# Altium schematic sheet CHIBI CODEC DSP_20181126.SchDoc: Title
size A2; PageSetup: Record=PageOptions|CenterHorizontal=True|CenterVertical=True|PrintScale=0.49|XCorrection=1.00|YCorrection=1.00|PrintKind=0|BorderSize=5000000|LeftOffset=0|BottomOffset=0|Orientation=2|PaperLength=1000|PaperWidth=1000|Scale=100|PaperSource=7|PrintQuality=-4|MediaType=1|DitherType=10|PaperKind=Letter|PrintScaleMode=1; ApprovedBy: Enter Name; CheckedBy: Enter Name; DrawnBy: Enter Name; Organization: Tymphany; Address1: 2/F, BBK Building; Address2: No. 89 Ande Street, Shang Meilin; Address3: Futian District, Shenzhen; Address4: GuangDong, P.R.C. 518049, China; DocumentNumber: 4; Revision: 0.0.0; SheetNumber: 4; SheetTotal: 6; ProductName: Product Name; PartNumber: Part Number; ModifiedBy: Enter Name; LeadEngineer: Enter Name; Stage: Concept; ProjectName: Project Name
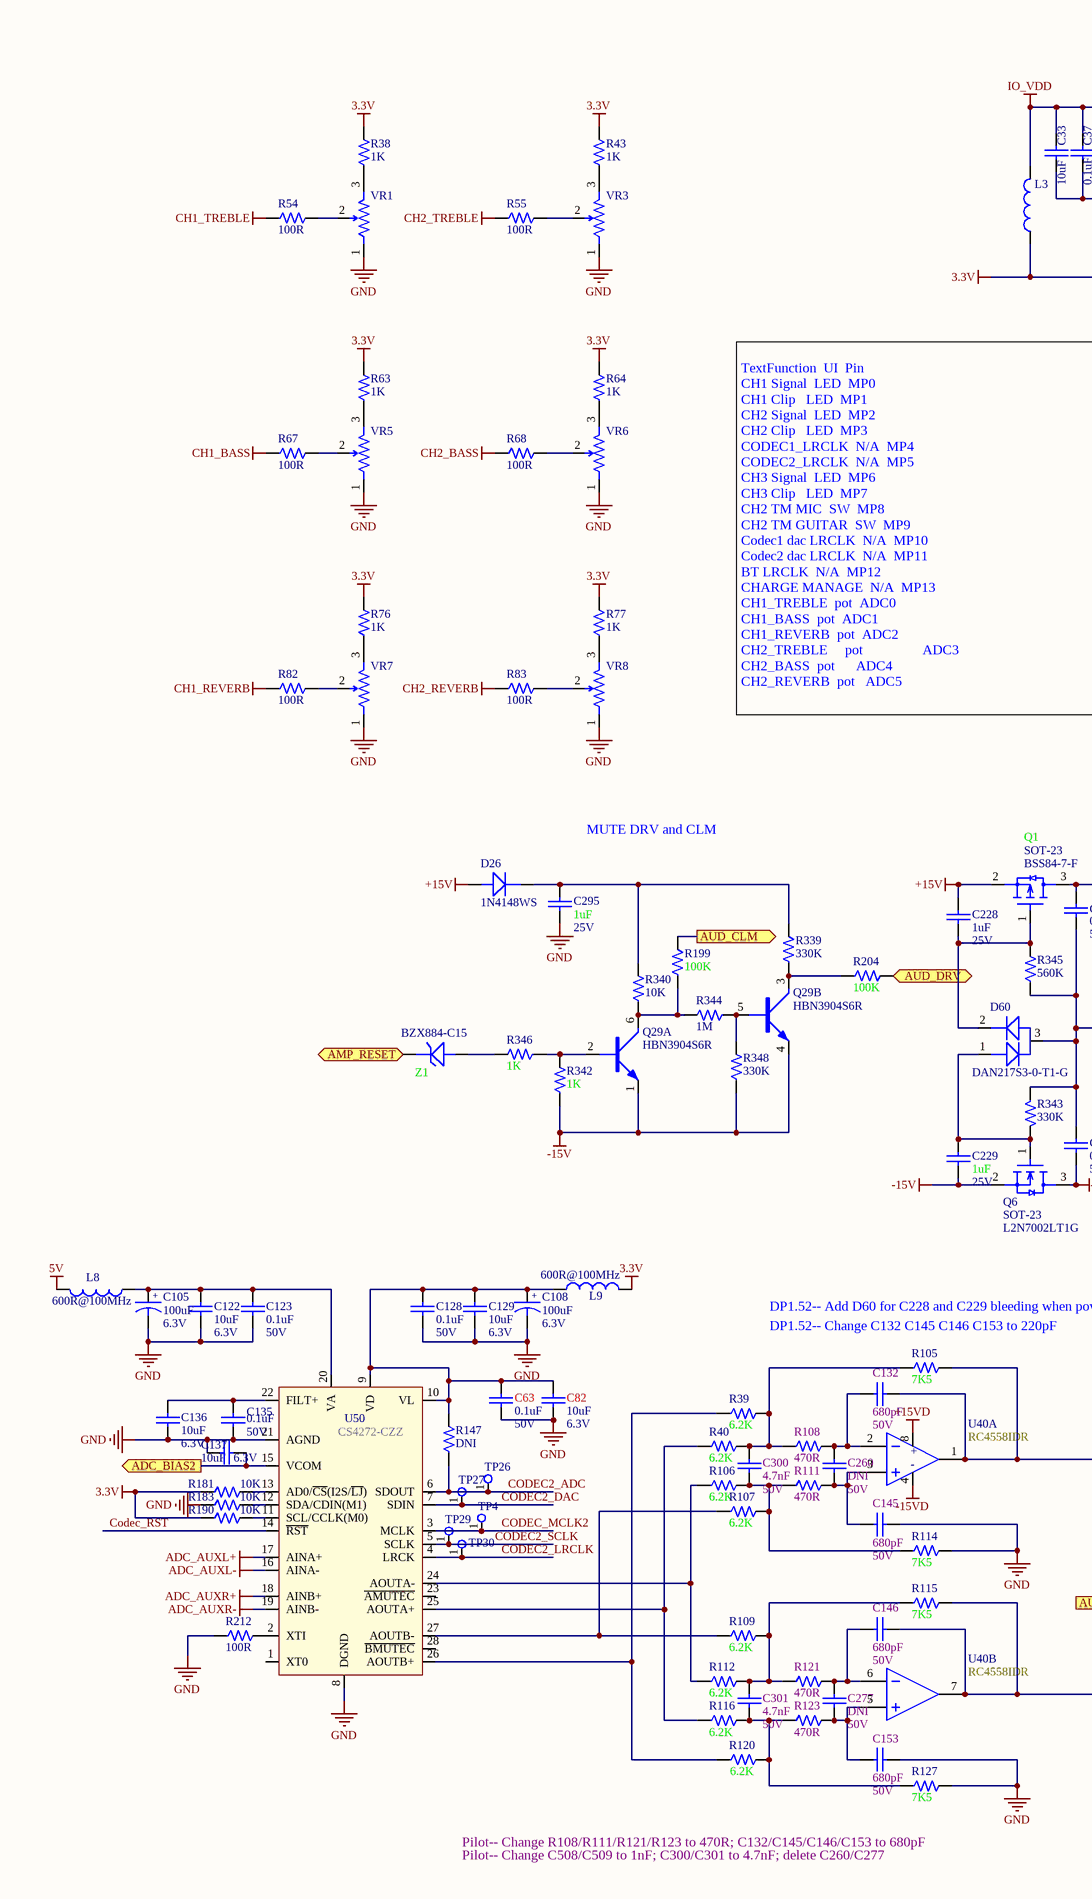
[diagram p0: CHIBI CODEC DSP_20181126.SchDoc, left]
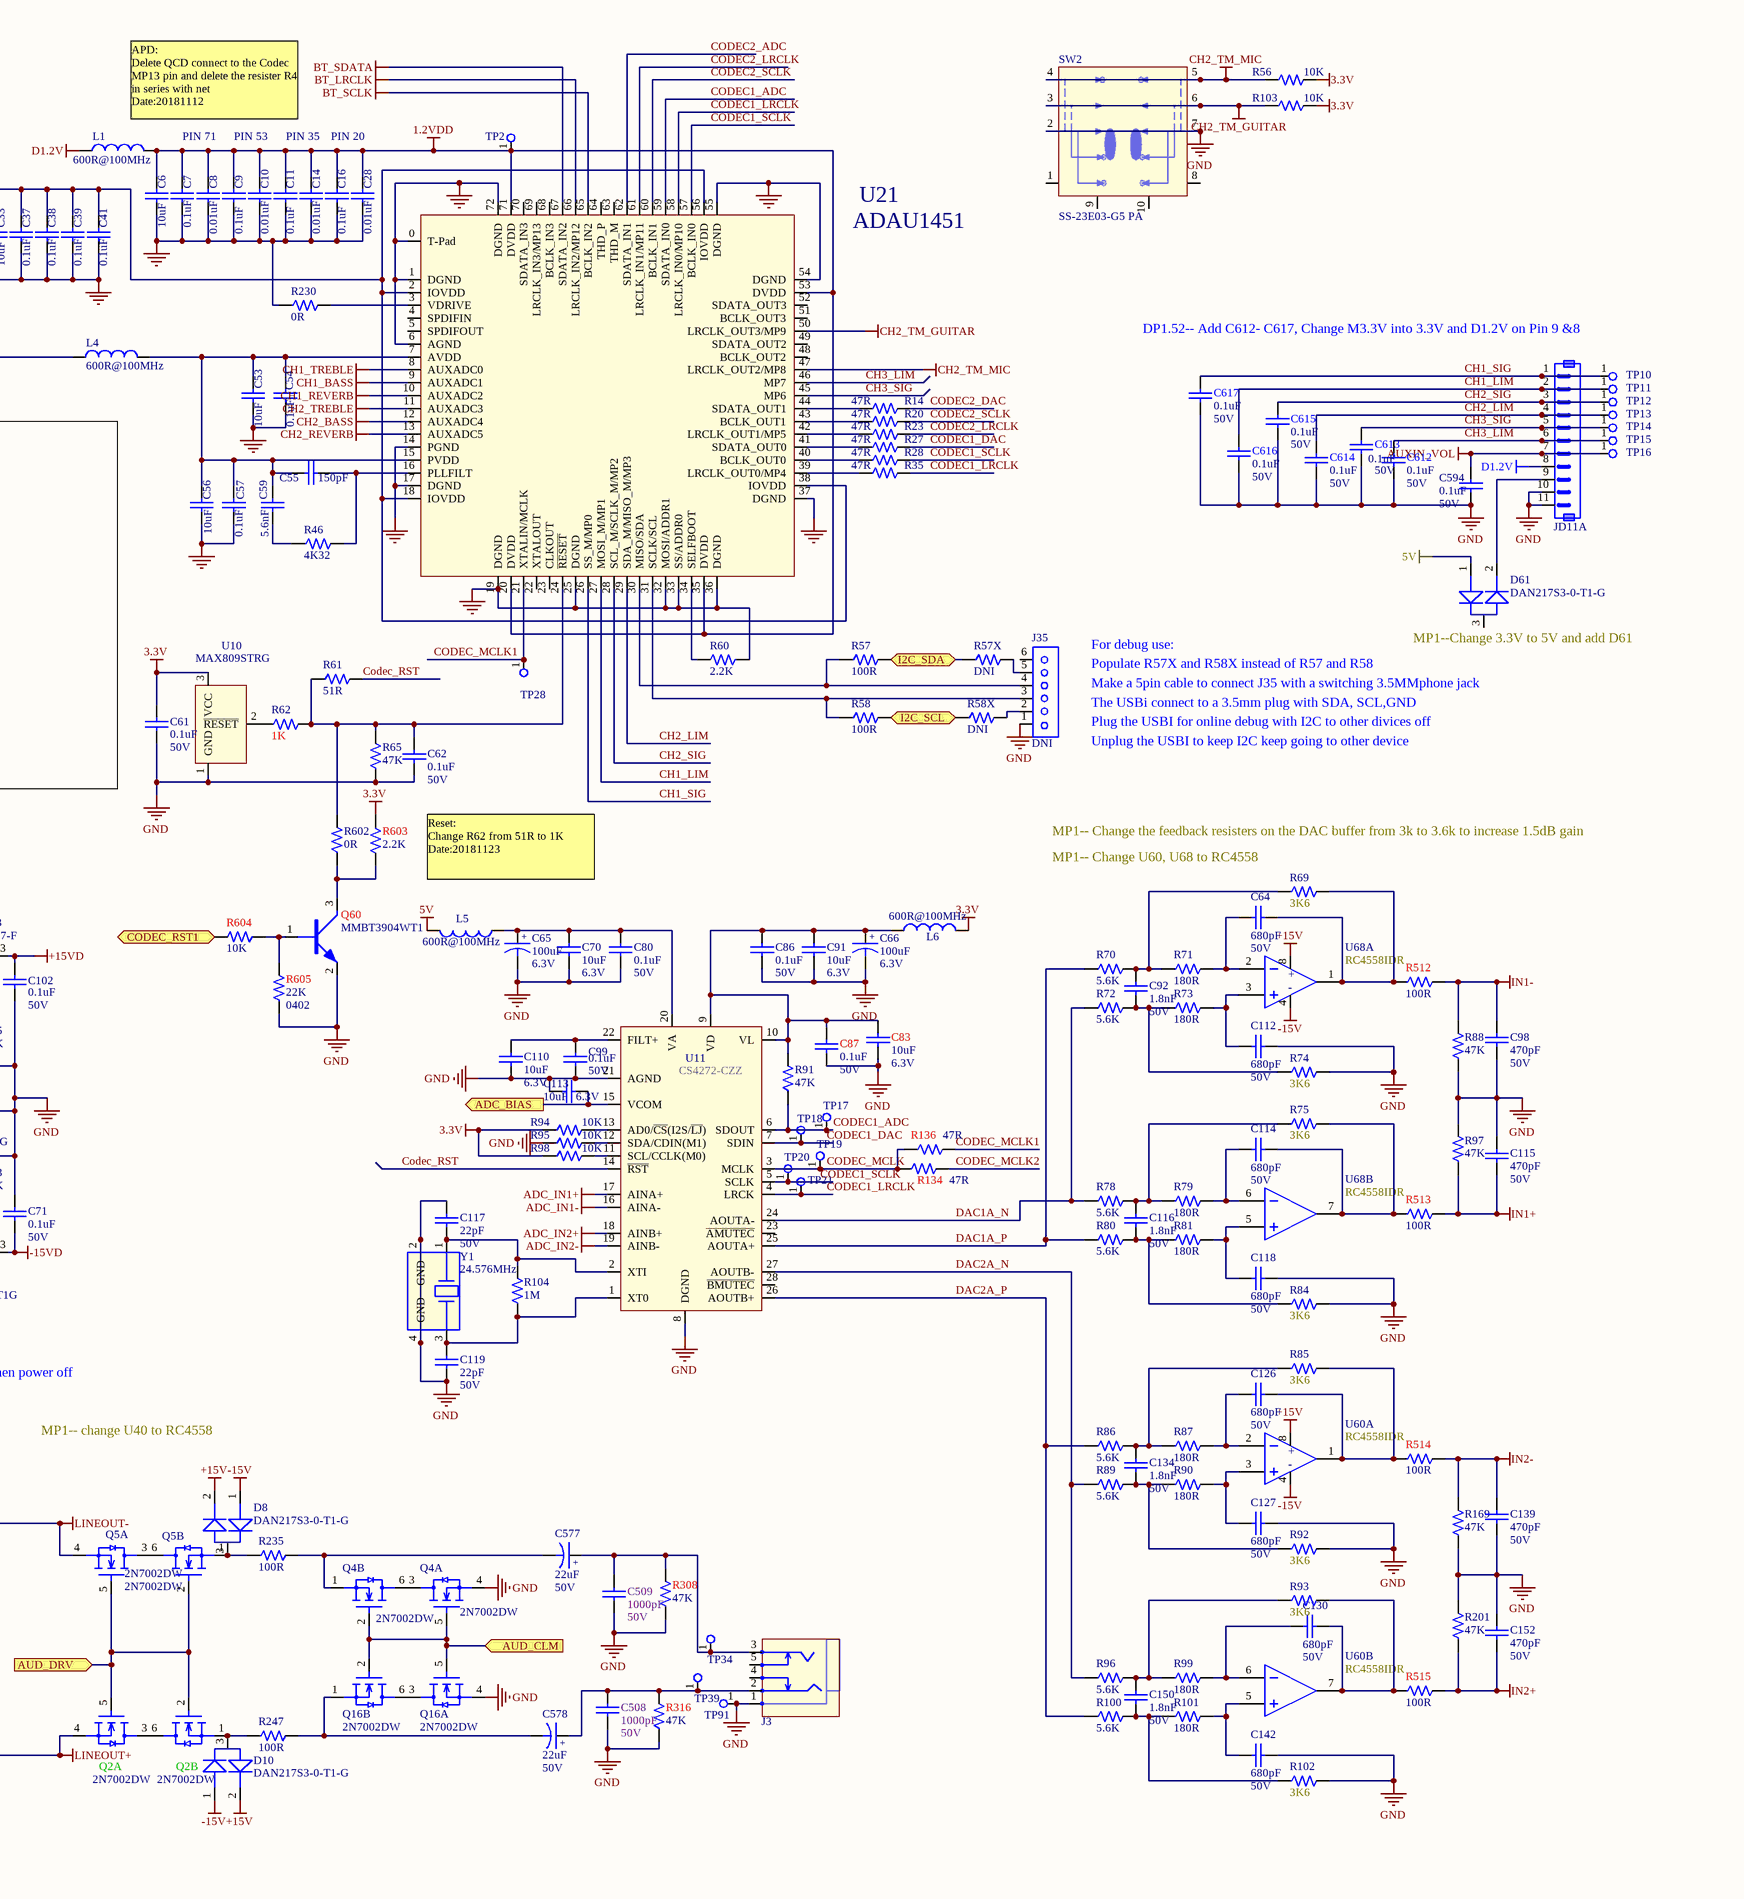
[diagram p1: CHIBI CODEC DSP_20181126.SchDoc, right]

## Parts
C6  value 10uF  [CAPC0603-RW]  (hidden comment: PXL426521-1060)
C7  value 0.1uF  [CAPC0402-RW]  (hidden comment: PWL456470-1040)
C8  value 0.01uF  [CAPC0402-RW]  (hidden comment: PWL456470-1030)
C9  value 0.1uF  [CAPC0402-RW]  (hidden comment: PWL456470-1040)
C10  value 0.01uF  [CAPC0402-RW]  (hidden comment: PWL456470-1030)
C11  value 0.1uF  [CAPC0402-RW]  (hidden comment: PWL456470-1040)
C14  value 0.01uF  [CAPC0402-RW]  (hidden comment: PWL456470-1030)
C16  value 0.1uF  [CAPC0402-RW]  (hidden comment: PWL456470-1040)
C28  value 0.01uF  [CAPC0402-RW]  (hidden comment: PWL456470-1030)
C33  value 10uF  [CAPC0603-RW]  (hidden comment: PXL426521-1060)
C37  value 0.1uF  [CAPC0402-RW]  (hidden comment: PWL456470-1040)
C38  value 0.1uF  [CAPC0402-RW]  (hidden comment: PWL456470-1040)
C39  value 0.1uF  [CAPC0402-RW]  (hidden comment: PWL456470-1040)
C41  value 0.1uF  [CAPC0402-RW]  (hidden comment: PWL456470-1040)
C53  value 10uF  [CAPC0603-RW]  (hidden comment: PXL426521-1060)
C54  value 0.1uF  [CAPC0402-RW]  (hidden comment: PWL456470-1040)
C55  value 150pF  [CAPC0603-RW]  (hidden comment: PXL456470-1510)
C56  value 10uF  [CAPC0603-RW]  (hidden comment: PXL426521-1060)
C57  value 0.1uF  [CAPC0402-RW]  (hidden comment: PWL456470-1040)
C59  value 5.6nF  [CAPC0402-RW]  (hidden comment: PWL456440-5620)
C61  value 0.1uF  Voltage: 50V  [CAPC0402-RW]  (hidden comment: PWL456470-1040)
C62  value 0.1uF  Voltage: 50V  [CAPC0402-RW]  (hidden comment: PWL456470-1040)
C63  value 0.1uF  Voltage: 50V  [CAPC0402-RW]  (hidden comment: PWL456470-1040)
C64  value 680pF  Voltage: 50V  [CAPC0402-RW]  (hidden comment: PWL410370-6810)
C65  value 100uF  Voltage: 6.3V  [CASE - C]  (hidden comment: PBE099520-1010)
C66  value 100uF  Voltage: 6.3V  [CASE - C]  (hidden comment: PBE099520-1010)
C70  value 10uF  Voltage: 6.3V  [CAPC0603-RW]  (hidden comment: PXL426521-1060)
C71  value 0.1uF  Voltage: 50V  [CAPC0402-RW]  (hidden comment: PWL456470-1040)
C80  value 0.1uF  Voltage: 50V  [CAPC0402-RW]  (hidden comment: PWL456470-1040)
C82  value 10uF  Voltage: 6.3V  [CAPC0603-RW]  (hidden comment: PXL426521-1060)
C83  value 10uF  Voltage: 6.3V  [CAPC0603-RW]  (hidden comment: PXL426521-1060)
C86  value 0.1uF  Voltage: 50V  [CAPC0402-RW]  (hidden comment: PWL456470-1040)
C87  value 0.1uF  Voltage: 50V  [CAPC0402-RW]  (hidden comment: PWL456470-1040)
C91  value 10uF  Voltage: 6.3V  [CAPC0603-RW]  (hidden comment: PXL426521-1060)
C92  value 1.8nF  Voltage: 50V  [CAPC0603-RW]  (hidden comment: PXL456470-1820)
C98  value 470pF  Voltage: 50V  [CAPC0402-RW]  (hidden comment: PWL410370-4710)
C99  value 0.1uF  Voltage: 50V  [CAPC0402-RW]  (hidden comment: PWL456470-1040)
C102  value 0.1uF  Voltage: 50V  [CAPC0402-RW]  (hidden comment: PWL456470-1040)
C105  value 100uF  Voltage: 6.3V  [CASE - C]  (hidden comment: PBE099520-1010)
C108  value 100uF  Voltage: 6.3V  [CASE - C]  (hidden comment: PBE099520-1010)
C110  value 10uF  Voltage: 6.3V  [CAPC0603-RW]  (hidden comment: PXL426521-1060)
C112  value 680pF  Voltage: 50V  [CAPC0402-RW]  (hidden comment: PWL410370-6810)
C113  value 10uF  Voltage: 6.3V  [CAPC0603-RW]  (hidden comment: PXL426521-1060)
C114  value 680pF  Voltage: 50V  [CAPC0402-RW]  (hidden comment: PWL410370-6810)
C115  value 470pF  Voltage: 50V  [CAPC0402-RW]  (hidden comment: PWL410370-4710)
C116  value 1.8nF  Voltage: 50V  [CAPC0603-RW]  (hidden comment: PXL456470-1820)
C117  value 22pF  Voltage: 50V  [CAPC0402-RW]  (hidden comment: PWL410370-2200)
C118  value 680pF  Voltage: 50V  [CAPC0402-RW]  (hidden comment: PWL410370-6810)
C119  value 22pF  Voltage: 50V  [CAPC0402-RW]  (hidden comment: PWL410370-2200)
C122  value 10uF  Voltage: 6.3V  [CAPC0603-RW]  (hidden comment: PXL426521-1060)
C123  value 0.1uF  Voltage: 50V  [CAPC0402-RW]  (hidden comment: PWL456470-1040)
C126  value 680pF  Voltage: 50V  [CAPC0402-RW]  (hidden comment: PWL410370-6810)
C127  value 680pF  Voltage: 50V  [CAPC0402-RW]  (hidden comment: PWL410370-6810)
C128  value 0.1uF  Voltage: 50V  [CAPC0402-RW]  (hidden comment: PWL456470-1040)
C129  value 10uF  Voltage: 6.3V  [CAPC0603-RW]  (hidden comment: PXL426521-1060)
C130  value 680pF  Voltage: 50V  [CAPC0402-RW]  (hidden comment: PWL410370-6810)
C132  value 680pF  Voltage: 50V  [CAPC0402-RW]  (hidden comment: PWL410370-6810)
C134  value 1.8nF  Voltage: 50V  [CAPC0603-RW]  (hidden comment: PXL456470-1820)
C135  value 0.1uF  Voltage: 50V  [CAPC0402-RW]  (hidden comment: PWL456470-1040)
C136  value 10uF  Voltage: 6.3V  [CAPC0603-RW]  (hidden comment: PXL426521-1060)
C137  value 10uF  Voltage: 6.3V  [CAPC0603-RW]  (hidden comment: PXL426521-1060)
C139  value 470pF  Voltage: 50V  [CAPC0402-RW]  (hidden comment: PWL410370-4710)
C142  value 680pF  Voltage: 50V  [CAPC0402-RW]  (hidden comment: PWL410370-6810)
C145  value 680pF  Voltage: 50V  [CAPC0402-RW]  (hidden comment: PWL410370-6810)
C146  value 680pF  Voltage: 50V  [CAPC0402-RW]  (hidden comment: PWL410370-6810)
C150  value 1.8nF  Voltage: 50V  [CAPC0603-RW]  (hidden comment: PXL456470-1820)
C152  value 470pF  Voltage: 50V  [CAPC0402-RW]  (hidden comment: PWL410370-4710)
C153  value 680pF  Voltage: 50V  [CAPC0402-RW]  (hidden comment: PWL410370-6810)
C228  value 1uF  Voltage: 25V  [CAPC0603-RW]  (hidden comment: PXL456450-1050)
C229  value 1uF  Voltage: 25V  [CAPC0603-RW]  (hidden comment: PXL456450-1050)
C260  value DNI  Voltage: 50V  [CAPC0402-RW]  (hidden comment: PWL410370-2700)
C277  value DNI  Voltage: 50V  [CAPC0402-RW]  (hidden comment: PWL410370-2700)
C295  value 1uF  Voltage: 25V  [CAPC0603-RW]  (hidden comment: PXL456450-1050)
C300  value 4.7nF  Voltage: 50V  [CAPC0603-RW]  (hidden comment: PXL456470-4720)
C301  value 4.7nF  Voltage: 50V  [CAPC0603-RW]  (hidden comment: PXL456470-4720)
C508  value 1000pF  Voltage: 50V  [CAPC0603-RW]  (hidden comment: T541021025508)
C509  value 1000pF  Voltage: 50V  [CAPC0603-RW]  (hidden comment: T541021025508)
C577  value 22uF  Voltage: 50V  [CASE - D]  (hidden comment: PBE099570-2200)
C578  value 22uF  Voltage: 50V  [CASE - D]  (hidden comment: PBE099570-2200)
C594  value 0.1uF  Voltage: 50V  [CAPC0402-RW]  (hidden comment: PWL456470-1040)
C612  value 0.1uF  Voltage: 50V  [CAPC0402-RW]  (hidden comment: PWL456470-1040)
C613  value 0.1uF  Voltage: 50V  [CAPC0402-RW]  (hidden comment: PWL456470-1040)
C614  value 0.1uF  Voltage: 50V  [CAPC0402-RW]  (hidden comment: PWL456470-1040)
C615  value 0.1uF  Voltage: 50V  [CAPC0402-RW]  (hidden comment: PWL456470-1040)
C616  value 0.1uF  Voltage: 50V  [CAPC0402-RW]  (hidden comment: PWL456470-1040)
C617  value 0.1uF  Voltage: 50V  [CAPC0402-RW]  (hidden comment: PWL456470-1040)
D8  T572006171251  [SOT323(SC-70)-R]  (value not drawn)
D10  T572006171251  [SOT323(SC-70)-R]  (value not drawn)
D26  RCD114148-0020  [SOD-323]  (value not drawn)
D60  T572006171251  [SOT323(SC-70)-R]  (value not drawn)
D61  T572006171251  [SOT323(SC-70)-R]  (value not drawn)
J3  T690300121700  [PHONE JACK 6.35mm Switched CK6.35-3-14-18LF]  (value not drawn)
J35  value DNI  [CONN 6P PH=2.0MM ST_PH-6A-CS]  (hidden comment: T690300108800)
JD11A  T690300109300  [CONN 11P PH=1.5MM ST SMT ZH-11AT-JK]  (value not drawn)
L1  value 600R@100MHz  [L0603-RW]  (hidden comment: SCBA06031-6010)
L3  SCBA06031-6010  [L0603-RW]  (value not drawn)
L4  value 600R@100MHz  [L0603-RW]  (hidden comment: SCBA06031-6010)
L5  value 600R@100MHz  [L0603-RW]  (hidden comment: SCBA06031-6010)
L6  value 600R@100MHz  [L0603-RW]  (hidden comment: SCBA06031-6010)
L8  value 600R@100MHz  [L0603-RW]  (hidden comment: SCBA06031-6010)
L9  value 600R@100MHz  [L0603-RW]  (hidden comment: SCBA06031-6010)
Q1  Package: SOT-23  [SOT23-132-RW]  (hidden comment: T585001160438)
Q2  RCM027002-1001  [SOT-363]  (value not drawn)  (parts A,B of 2)
Q4  RCM027002-1001  [SOT-363]  (value not drawn)  (parts A,B of 2)
Q5  RCM027002-1001  [SOT-363]  (value not drawn)  (parts A,B of 2)
Q6  Package: SOT-23  [SOT23-132-RW]  (hidden comment: RCM207002-1001)
Q16  RCM027002-1001  [SOT-363]  (value not drawn)  (parts A,B of 2)
Q29  T581004124899  [SOT-363]  (value not drawn)  (parts A,B of 2)
Q60  T581003992440  [SOT323(SC-70)-R]  (value not drawn)
R14  value 47R  [0402-RW]  (hidden comment: QCF161240-4709)
R20  value 47R  [0402-RW]  (hidden comment: QCF161240-4709)
R23  value 47R  [0402-RW]  (hidden comment: QCF161240-4709)
R27  value 47R  [0402-RW]  (hidden comment: QCF161240-4709)
R28  value 47R  [0402-RW]  (hidden comment: QCF161240-4709)
R35  value 47R  [0402-RW]  (hidden comment: QCF161240-4709)
R38  value 1K  [0402-RW]  (hidden comment: QCF161240-1001)
R39  value 6.2K  [0402-RW]  (hidden comment: T502620101399)
R40  value 6.2K  [0402-RW]  (hidden comment: T502620101399)
R43  value 1K  [0402-RW]  (hidden comment: QCF161240-1001)
R46  value 4K32  [0402-RW]  (hidden comment: T502432101399)
R54  value 100R  [0402-RW]  (hidden comment: QCF161240-1000)
R55  value 100R  [0402-RW]  (hidden comment: QCF161240-1000)
R56  value 10K  [0402-RW]  (hidden comment: QCF161240-1002)
R57  value 100R  [0402-RW]  (hidden comment: QCF161240-1000)
R57X  value DNI  [0402-RW]  (hidden comment: QCF161240-1000)
R58  value 100R  [0402-RW]  (hidden comment: QCF161240-1000)
R58X  value DNI  [0402-RW]  (hidden comment: QCF161240-1000)
R60  value 2.2K  [0402-RW]  (hidden comment: QCF161240-2201)
R61  value 51R  [0402-RW]  (hidden comment: QCF161240-5109)
R62  value 1K  [0603-RW]  (hidden comment: QCF011030-1001)
R63  value 1K  [0402-RW]  (hidden comment: QCF161240-1001)
R64  value 1K  [0402-RW]  (hidden comment: QCF161240-1001)
R65  value 47K  [0402-RW]  (hidden comment: QCF161243-4702)
R67  value 100R  [0402-RW]  (hidden comment: QCF161240-1000)
R68  value 100R  [0402-RW]  (hidden comment: QCF161240-1000)
R69  value 3K6  [0402-RW]  (hidden comment: T502360101399)
R70  value 5.6K  [0402-RW]  (hidden comment: T502560101399)
R71  value 180R  [0402-RW]  (hidden comment: T502180001399)
R72  value 5.6K  [0402-RW]  (hidden comment: T502560101399)
R73  value 180R  [0402-RW]  (hidden comment: T502180001399)
R74  value 3K6  [0402-RW]  (hidden comment: T502360101399)
R75  value 3K6  [0402-RW]  (hidden comment: T502360101399)
R76  value 1K  [0402-RW]  (hidden comment: QCF161240-1001)
R77  value 1K  [0402-RW]  (hidden comment: QCF161240-1001)
R78  value 5.6K  [0402-RW]  (hidden comment: T502560101399)
R79  value 180R  [0402-RW]  (hidden comment: T502180001399)
R80  value 5.6K  [0402-RW]  (hidden comment: T502560101399)
R81  value 180R  [0402-RW]  (hidden comment: T502180001399)
R82  value 100R  [0402-RW]  (hidden comment: QCF161240-1000)
R83  value 100R  [0402-RW]  (hidden comment: QCF161240-1000)
R84  value 3K6  [0402-RW]  (hidden comment: T502360101399)
R85  value 3K6  [0402-RW]  (hidden comment: T502360101399)
R86  value 5.6K  [0402-RW]  (hidden comment: T502560101399)
R87  value 180R  [0402-RW]  (hidden comment: T502180001399)
R88  value 47K  [0402-RW]  (hidden comment: QCF161243-4702)
R89  value 5.6K  [0402-RW]  (hidden comment: T502560101399)
R90  value 180R  [0402-RW]  (hidden comment: T502180001399)
R91  value 47K  [0402-RW]  (hidden comment: QCF161243-4702)
R92  value 3K6  [0402-RW]  (hidden comment: T502360101399)
R93  value 3K6  [0402-RW]  (hidden comment: T502360101399)
R94  value 10K  [0402-RW]  (hidden comment: QCF161240-1002)
R95  value 10K  [0402-RW]  (hidden comment: QCF161240-1002)
R96  value 5.6K  [0402-RW]  (hidden comment: T502560101399)
R97  value 47K  [0402-RW]  (hidden comment: QCF161243-4702)
R98  value 10K  [0402-RW]  (hidden comment: QCF161240-1002)
R99  value 180R  [0402-RW]  (hidden comment: T502180001399)
R100  value 5.6K  [0402-RW]  (hidden comment: T502560101399)
R101  value 180R  [0402-RW]  (hidden comment: T502180001399)
R102  value 3K6  [0402-RW]  (hidden comment: T502360101399)
R103  value 10K  [0402-RW]  (hidden comment: QCF161240-1002)
R104  value 1M  [0402-RW]  (hidden comment: QCF161240-1004)
R105  value 7K5  [0402-RW]  (hidden comment: T502750101399)
R106  value 6.2K  [0402-RW]  (hidden comment: T502620101399)
R107  value 6.2K  [0402-RW]  (hidden comment: T502620101399)
R108  value 470R  [0402-RW]  (hidden comment: QCF161240-4700)
R109  value 6.2K  [0402-RW]  (hidden comment: T502620101399)
R111  value 470R  [0402-RW]  (hidden comment: QCF161240-4700)
R112  value 6.2K  [0402-RW]  (hidden comment: T502620101399)
R114  value 7K5  [0402-RW]  (hidden comment: T502750101399)
R115  value 7K5  [0402-RW]  (hidden comment: T502750101399)
R116  value 6.2K  [0402-RW]  (hidden comment: T502620101399)
R120  value 6.2K  [0402-RW]  (hidden comment: T502620101399)
R121  value 470R  [0402-RW]  (hidden comment: QCF161240-4700)
R123  value 470R  [0402-RW]  (hidden comment: QCF161240-4700)
R127  value 7K5  [0402-RW]  (hidden comment: T502750101399)
R134  value 47R  [0402-RW]  (hidden comment: QCF161240-4709)
R136  value 47R  [0402-RW]  (hidden comment: QCF161240-4709)
R147  value DNI  [0402-RW]  (hidden comment: QCF161243-4702)
R169  value 47K  [0402-RW]  (hidden comment: QCF161243-4702)
R181  value 10K  [0402-RW]  (hidden comment: QCF161240-1002)
R183  value 10K  [0402-RW]  (hidden comment: QCF161240-1002)
R190  value 10K  [0402-RW]  (hidden comment: QCF161240-1002)
R199  value 100K  [0402-RW]  (hidden comment: QCF161240-1003)
R201  value 47K  [0402-RW]  (hidden comment: QCF161243-4702)
R204  value 100K  [0402-RW]  (hidden comment: QCF161240-1003)
R212  value 100R  [0402-RW]  (hidden comment: QCF161240-1000)
R230  value 0R  [0402-RW]  (hidden comment: QCF165240-0000)
R235  value 100R  [0603-RW]  (hidden comment: QCF011030-1000)
R247  value 100R  [0603-RW]  (hidden comment: QCF011030-1000)
R308  value 47K  [0603-RW]  (hidden comment: QCF011030-4702)
R316  value 47K  [0603-RW]  (hidden comment: QCF011030-4702)
R339  value 330K  [0603-RW]  (hidden comment: QCF011030-3303)
R340  value 10K  [0402-RW]  (hidden comment: QCF161240-1002)
R342  value 1K  [0402-RW]  (hidden comment: QCF161240-1001)
R343  value 330K  [0603-RW]  (hidden comment: QCF011030-3303)
R344  value 1M  [0402-RW]  (hidden comment: QCF161240-1004)
R345  value 560K  [0402-RW]  (hidden comment: QCF161240-5603)
R346  value 1K  [0402-RW]  (hidden comment: QCF161240-1001)
R348  value 330K  [0603-RW]  (hidden comment: QCF011030-3303)
R512  value 100R  [0402-RW]  (hidden comment: QCF161240-1000)
R513  value 100R  [0402-RW]  (hidden comment: QCF161240-1000)
R514  value 100R  [0402-RW]  (hidden comment: QCF161240-1000)
R515  value 100R  [0402-RW]  (hidden comment: QCF161240-1000)
R602  value 0R  [0603-RW]  (hidden comment: T502000002009)
R603  value 2.2K  [0402-RW]  (hidden comment: QCF161240-2201)
R604  value 10K  [0402-RW]  (hidden comment: QCF161240-1002)
R605  value 22K  PACKAGE: 0402  [0402-RW]  (hidden comment: QCF161240-2202)
SW2  T670600002700  [SS-23E03-G5 PA]  (value not drawn)
TP2  TP  [TP_1.0mm]  (value not drawn)
TP4  MCLK  [TP_1.2mm]  (value not drawn)
TP10  TP  [TP_1.0mm]  (value not drawn)
TP11  TP  [TP_1.0mm]  (value not drawn)
TP12  TP  [TP_1.0mm]  (value not drawn)
TP13  TP  [TP_1.0mm]  (value not drawn)
TP14  TP  [TP_1.0mm]  (value not drawn)
TP15  TP  [TP_1.0mm]  (value not drawn)
TP16  TP  [TP_1.0mm]  (value not drawn)
TP17  SDO  [TP_1.2mm]  (value not drawn)
TP18  SDI  [TP_1.2mm]  (value not drawn)
TP19  MCLK  [TP_1.2mm]  (value not drawn)
TP20  SCLK  [TP_1.2mm]  (value not drawn)
TP21  LRCK  [TP_1.2mm]  (value not drawn)
TP26  SDO  [TP_1.2mm]  (value not drawn)
TP27  SDI  [TP_1.2mm]  (value not drawn)
TP28  MCLK  [TP_1.2mm]  (value not drawn)
TP29  SCLK  [TP_1.2mm]  (value not drawn)
TP30  LRCK  [TP_1.2mm]  (value not drawn)
TP34  GND  [TP_1.2mm]  (value not drawn)
TP39  CON4_2  [TP_1.2mm]  (value not drawn)
TP91  CON3_2  [TP_1.2mm]  (value not drawn)
U10  MFG Part: MAX809STRG  [SOT23-132-SW]  (hidden comment: T610300090588)
U11  RCI004272-0001  [TSSOP28]  (value not drawn)
U21  T610000050936  [QFN50P1000X1000X100-72N]  (value not drawn)
U40  T610500019101  [D(R-PDSO-G8)]  (value not drawn)  (parts A,B of 2)
U50  RCI004272-0001  [TSSOP28]  (value not drawn)
U60  T610500019101  [D(R-PDSO-G8)]  (value not drawn)  (parts A,B of 2)
U68  T610500019101  [D(R-PDSO-G8)]  (value not drawn)  (parts A,B of 2)
VR1  MVRA02101-1030  [RV09BCF-40-25F-B10K]  (value not drawn)
VR3  MVRA02101-1030  [RV09BCF-40-25F-B10K]  (value not drawn)
VR5  MVRA02101-1030  [RV09BCF-40-25F-B10K]  (value not drawn)
VR6  MVRA02101-1030  [RV09BCF-40-25F-B10K]  (value not drawn)
VR7  MVRA02101-1030  [RV09BCF-40-25F-B10K]  (value not drawn)
VR8  MVRA02101-1030  [RV09BCF-40-25F-B10K]  (value not drawn)
Y1  Frequency: 24.576MHz  [SMD3225]  (hidden comment: T690900003500)
Z1  RCZ025015-0010  [SOD882]  (value not drawn)

## Ports
ADC_BIAS2 (out), ADC_BIAS (out), AMP_RESET (in), AUD_CLM (in), AUD_CLM (out), AUD_DRV (in), AUD_DRV (out), CODEC_RST1 (in), I2C_SCL (bidir), I2C_SDA (bidir)

## Nets
1.2VDD: C6.2 C7.2 C8.2 C9.2 C10.2 C11.2 C14.2 C16.2 C28.2 L1.2 TP2.1 U21.20(DVDD) U21.35(DVDD) U21.53(DVDD) U21.71(DVDD)
3.3V: C61.1 L3.1 L4.1 L6.2 L9.2 R38.2 R43.2 R56.2 R63.2 R64.2 R76.2 R77.2 R94.1 R98.1 R103.2 R181.1 R190.1 R603.1 U10.3(VCC)
5V: D61.1(A) L5.2 L8.2
+15V: C228.1 D8.2(K) D10.2(K) D26.1(A) Q1.2(S) U60.8(VCC+) U68.8(VCC+)
+15VD: C102.1 Q1.3(D) U40.8(VCC+)
-15V: C229.1 D8.1(A) D10.1(A) Q6.2(S) Q29.1(E) Q29.4(E) R342.1 R348.1 U60.4(VCC-) U68.4(VCC-)
-15VD: C71.1 Q6.3(D) U40.4(VCC-)
ADC_AUXL+: U50.17(AINA+)
ADC_AUXL-: U50.16(AINA-)
ADC_AUXR+: U50.18(AINB+)
ADC_AUXR-: U50.19(AINB-)
ADC_IN1+: U11.17(AINA+)
ADC_IN1-: U11.16(AINA-)
ADC_IN2+: U11.18(AINB+)
ADC_IN2-: U11.19(AINB-)
AUXIN_VOL: C594.1 JD11A.7 TP16.1
BT_LRCLK: U21.66(LRCLK_IN2/MP12)
BT_SCLK: U21.65(BCLK_IN2)
BT_SDATA: U21.67(SDATA_IN2)
CH1_BASS: R67.1 U21.9(AUXADC1)
CH1_REVERB: R82.1 U21.10(AUXADC2)
CH1_TREBLE: R54.1 U21.8(AUXADC0)
CH2_BASS: R68.1 U21.12(AUXADC4)
CH2_REVERB: R83.1 U21.13(AUXADC5)
CH2_TM_GUITAR: R103.1 SW2.3 SW2.6 U21.50(LRCLK_OUT3/MP9)
CH2_TM_MIC: R56.1 SW2.4 SW2.5 U21.47(LRCLK_OUT2/MP8)
CH2_TREBLE: R55.1 U21.11(AUXADC3)
D1.2V: JD11A.8 L1.1
GND: C6.1 C7.1 C8.1 C9.1 C10.1 C11.1 C14.1 C16.1 C28.1 C33.2 C37.1 C38.1 C39.1 C41.1 C53.2 C54.1 C56.2 C57.1 C61.2 C62.2 C63.2 C65.2 C66.2 C70.2 C71.2 C80.2 C82.2 C83.2 C86.2 C87.2 C91.2 C98.2 C99.2 C102.2 C105.2 C108.2 C110.2 C112.2 C113.2 C115.1 C117.1 C118.2 C119.2 C122.2 C123.2 C127.2 C128.2 C129.2 C135.2 C136.2 C137.2 C139.2 C142.2 C145.2 C152.1 C153.2 C295.2 C508.1 C509.1 C594.2 C612.2 C613.2 C614.2 C615.2 C616.2 C617.2 D60.3(C) J3.1 J35.1 JD11A.10 JD11A.11 Q4.4(S) Q16.4(S) Q60.2(E) R60.1 R65.1 R74.2 R84.2 R88.1 R92.2 R95.1 R97.2 R102.2 R114.2 R127.2 R169.1 R183.1 R201.2 R212.1 R230.1 R308.1 R316.1 R343.1 R345.1 R605.1 SW2.2 SW2.7 TP91.1 U10.1(GND) U11.8(DGND) U11.21(AGND) U21.0(T-Pad) U21.1(DGND) U21.6(AGND) U21.14(PGND) U21.17(DGND) U21.19(DGND) U21.25(DGND) U21.32(MOSI/ADDR1) U21.33(SS/ADDR0) U21.36(DGND) U21.37(DGND) U21.54(DGND) U21.55(DGND) U21.72(DGND) U50.8(DGND) U50.21(AGND) VR1.1 VR3.1 VR5.1 VR6.1 VR7.1 VR8.1 Y1.2(GND) Y1.4(GND)
IN1+: C115.2 R97.1 R513.2
IN1-: C98.1 R88.2 R512.2
IN2+: C152.2 R201.1 R515.2
IN2-: C139.1 R169.2 R514.2
IO_VDD: C33.1 C37.2 C38.2 C39.2 C41.2 L3.2 U21.2(IOVDD) U21.18(IOVDD) U21.38(IOVDD) U21.56(IOVDD)
LINEOUT+: C146.2 Q2.4(S) R115.2 U40.7(2OUT)
LINEOUT-: C132.2 Q5.4(S) R105.2 U40.1(1OUT)
ADC_BIAS: C113.1 U11.15(VCOM) ; port ADC_BIAS
ADC_BIAS2: C137.1 U50.15(VCOM) ; port ADC_BIAS2
AMP_RESET: Z1.2(K) ; port AMP_RESET
AUD_CLM: Q4.2(G) Q4.5(G) Q16.2(G) Q16.5(G) R199.2 ; port AUD_CLM
AUD_DRV: Q2.2(G) Q2.5(G) Q5.2(G) Q5.5(G) R204.2 ; port AUD_DRV
CH1_LIM: C616.1 JD11A.2 TP11.1 U21.27(MOSI_M/MP1)
CH1_SIG: C617.1 JD11A.1 TP10.1 U21.26(SS_M/MP0)
CH2_LIM: C614.1 JD11A.4 TP13.1 U21.29(SDA_M/MISO_M/MP3)
CH2_SIG: C615.1 JD11A.3 TP12.1 U21.28(SCL_M/SCLK_M/MP2)
CH3_LIM: C612.1 JD11A.6 TP15.1 U21.46(MP7)
CH3_SIG: C613.1 JD11A.5 TP14.1 U21.45(MP6)
CODEC1_ADC: R91.1 TP17.1 U11.6(SDOUT) U21.59(SDATA_IN0)
CODEC1_DAC: R27.2 TP18.1 U11.7(SDIN)
CODEC1_LRCLK: R35.2 TP21.1 U11.4(LRCK) U21.58(LRCLK_IN0/MP10)
CODEC1_SCLK: R28.2 TP20.1 U11.5(SCLK) U21.57(BCLK_IN0)
CODEC2_ADC: R147.1 TP26.1 U21.62(SDATA_IN1) U50.6(SDOUT)
CODEC2_DAC: R14.2 TP27.1 U50.7(SDIN)
CODEC2_LRCLK: R23.2 TP30.1 U21.61(LRCLK_IN1/MP11) U50.4(LRCK)
CODEC2_SCLK: R20.2 TP29.1 U21.60(BCLK_IN1) U50.5(SCLK)
CODEC_MCLK: R134.1 R136.1 TP19.1 U11.3(MCLK)
CODEC_MCLK1: R136.2 TP28.1 U21.21(XTALIN/MCLK)
CODEC_MCLK2: R134.2 TP4.1 U50.3(MCLK)
Codec_RST: R61.2 U11.14(~{RST}) U50.14(~{RST})
CODEC_RST1: R604.2 ; port CODEC_RST1
DAC1A_N: R72.1 R78.1 U11.24(AOUTA-)
DAC1A_P: R70.1 R80.1 U11.25(AOUTA+)
DAC2A_N: R89.1 R96.1 U11.27(AOUTB-)
DAC2A_P: R86.1 R100.1 U11.26(AOUTB+)
I2C_SCL: R58.2 R58X.1 ; port I2C_SCL
I2C_SDA: R57.2 R57X.1 ; port I2C_SDA
NetC53_1: C53.1 C54.2 C55.1 C56.1 C57.2 C59.1 L4.2 U21.7(AVDD) U21.15(PVDD)
NetC55_2: C55.2 R46.2 U21.16(PLLFILT)
NetC59_2: C59.2 R46.1
NetC62_1: C62.1 R61.1 R62.2 R65.2 R602.2 U21.24(~{RESET})
NetC63_1: C63.1 C82.1 C108.1 C128.1 C129.1 L9.1 R147.2 U50.9(VD) U50.10(VL)
NetC64_1: C64.1 R71.2 U68.2(1IN-)
NetC64_2: C64.2 R69.2 R512.1 U68.1(1OUT)
NetC65_1: C65.1 C70.1 C80.1 L5.1 U11.20(VA)
NetC66_1: C66.1 C83.1 C86.1 C87.1 C91.1 L6.1 R91.2 U11.9(VD) U11.10(VL)
NetC92_1: C92.1 R69.1 R70.2 R71.1
NetC92_2: C92.2 R72.2 R73.1 R74.1
NetC99_1: C99.1 C110.1 U11.22(FILT+)
NetC105_1: C105.1 C122.1 C123.1 L8.1 U50.20(VA)
NetC112_1: C112.1 R73.2 U68.3(1IN+)
NetC114_1: C114.1 R79.2 U68.6(2IN-)
NetC114_2: C114.2 R75.2 R513.1 U68.7(2OUT)
NetC116_1: C116.1 R75.1 R78.2 R79.1
NetC116_2: C116.2 R80.2 R81.1 R84.1
NetC117_2: C117.2 R104.2 U11.2(XTI) Y1.1
NetC118_1: C118.1 R81.2 U68.5(2IN+)
NetC119_1: C119.1 R104.1 U11.1(XT0) Y1.3
NetC126_1: C126.1 R87.2 U60.2(1IN-)
NetC126_2: C126.2 R85.2 R514.1 U60.1(1OUT)
NetC127_1: C127.1 R90.2 U60.3(1IN+)
NetC130_1: C130.1 R99.2 U60.6(2IN-)
NetC130_2: C130.2 R93.2 R515.1 U60.7(2OUT)
NetC132_1: C132.1 C260.2 R108.2 U40.2(1IN-)
NetC134_1: C134.1 R85.1 R86.2 R87.1
NetC134_2: C134.2 R89.2 R90.1 R92.1
NetC135_1: C135.1 C136.1 U50.22(FILT+)
NetC142_1: C142.1 R101.2 U60.5(2IN+)
NetC145_1: C145.1 C260.1 R111.2 U40.3(1IN+)
NetC146_1: C146.1 C277.2 R121.2 U40.6(2IN-)
NetC150_1: C150.1 R93.1 R96.2 R99.1
NetC150_2: C150.2 R100.2 R101.1 R102.1
NetC153_1: C153.1 C277.1 R123.2 U40.5(2IN+)
NetC228_2: C228.2 D60.2(K) Q1.1(G) R345.2
NetC229_2: C229.2 D60.1(A) Q6.1(G) R343.2
NetC295_1: C295.1 D26.2(K) R339.2 R340.2
NetC300_1: C300.1 R39.2 R40.2 R105.1 R108.1
NetC300_2: C300.2 R106.2 R107.2 R111.1 R114.1
NetC301_1: C301.1 R109.2 R112.2 R115.1 R121.1
NetC301_2: C301.2 R116.2 R120.2 R123.1 R127.1
NetC508_2: C508.2 C578.1 J3.2 R316.2 TP39.1
NetC509_2: C509.2 C577.1 J3.3 R308.2 TP34.1
NetC577_2: C577.2 Q4.1(S) R235.2
NetC578_2: C578.2 Q16.1(S) R247.2
NetD8_3: D8.3(C) Q5.1(S) R235.1
NetD10_3: D10.3(C) Q2.1(S) R247.1
NetD61_2: D61.2(K) JD11A.9
NetJ35_2: J35.2 R58X.2
NetJ35_3: J35.3 R58.1 U21.31(SCLK/SCL)
NetJ35_4: J35.4 R57.1 U21.30(MISO/SDA)
NetJ35_5: J35.5 R57X.2
NetQ2_3: Q2.3(D) Q2.6(D)
NetQ4_3: Q4.3(D) Q4.6(D)
NetQ5_3: Q5.3(D) Q5.6(D)
NetQ16_3: Q16.3(D) Q16.6(D)
NetQ29_2: Q29.2(B) R342.2 R346.1
NetQ29_3: Q29.3(C) R204.1 R339.1
NetQ29_5: Q29.5(B) R344.1 R348.2
NetQ29_6: Q29.6(C) R199.1 R340.1 R344.2
NetQ60_1: Q60.1(B) R604.1 R605.2
NetQ60_3: Q60.3(C) R602.1 R603.2
NetR14_1: R14.1 U21.44(SDATA_OUT1)
NetR20_1: R20.1 U21.43(BCLK_OUT1)
NetR23_1: R23.1 U21.42(LRCLK_OUT1/MP5)
NetR27_1: R27.1 U21.41(SDATA_OUT0)
NetR28_1: R28.1 U21.40(BCLK_OUT0)
NetR35_1: R35.1 U21.39(LRCLK_OUT0/MP4)
NetR38_1: R38.1 VR1.3
NetR39_1: R39.1 R120.1 U50.26(AOUTB+)
NetR40_1: R40.1 R116.1 U50.25(AOUTA+)
NetR43_1: R43.1 VR3.3
NetR54_2: R54.2 VR1.2
NetR55_2: R55.2 VR3.2
NetR60_2: R60.2 U21.34(SELFBOOT)
NetR62_1: R62.1 U10.2(~{RESET})
NetR63_1: R63.1 VR5.3
NetR64_1: R64.1 VR6.3
NetR67_2: R67.2 VR5.2
NetR68_2: R68.2 VR6.2
NetR76_1: R76.1 VR7.3
NetR77_1: R77.1 VR8.3
NetR82_2: R82.2 VR7.2
NetR83_2: R83.2 VR8.2
NetR94_2: R94.2 U11.13(AD0/~{CS}(I2S/~{LJ}))
NetR95_2: R95.2 U11.12(SDA/CDIN(M1))
NetR98_2: R98.2 U11.11(SCL/CCLK(M0))
NetR106_1: R106.1 R112.1 U50.24(AOUTA-)
NetR107_1: R107.1 R109.1 U50.27(AOUTB-)
NetR181_2: R181.2 U50.13(AD0/~{CS}(I2S/~{LJ}))
NetR183_2: R183.2 U50.12(SDA/CDIN(M1))
NetR190_2: R190.2 U50.11(SCL/CCLK(M0))
NetR212_2: R212.2 U50.2(XTI)
NetR230_2: R230.2 U21.3(VDRIVE)
NetR346_2: R346.2 Z1.1(A)

Not connected (* = marked no-connect by the designer): D61 3(C); J3 4 5; J35 6; SW2 1 8 9 10; U11 23(~{AMUTEC}) 28(~{BMUTEC}); U21 4(SPDIFIN) 5(SPDIFOUT) 22(XTALOUT) 23(CLKOUT) 48(BCLK_OUT2) 49(SDATA_OUT2) 51(BCLK_OUT3) 52(SDATA_OUT3) 63(THD_M) 64(THD_P) 68(BCLK_IN3) 69(LRCLK_IN3/MP13) 70(SDATA_IN3); U50 1(XT0) 23(~{AMUTEC}) 28(~{BMUTEC})

## Notes on the sheet
- (near L1) APD:
  Delete QCD connect to the Codec MP13 pin and delete the resister R4 in series with net
  Date:20181112
- PIN 71
- PIN 53
- PIN 35
- PIN 20
- DP1.52-- Add C612- C617, Change M3.3V into 3.3V and D1.2V on Pin 9 &8
- Populate R57X and R58X instead of R57 and R58
- For debug use:
- (near D61) MP1--Change 3.3V to 5V and add D61
- Plug the USBI for online debug with I2C to other divices off
- Make a 5pin cable to connect J35 with a switching 3.5MMphone jack
- The USBi connect to a 3.5mm plug with SDA, SCL,GND
- (near C61) TextFunction		UI		Pin
  CH1 Signal		LED		MP0
  CH1 Clip			LED		MP1
  CH2 Signal		LED		MP2
  CH2 Clip			LED		MP3
  CODEC1_LRCLK		N/A		MP4
  CODEC2_LRCLK		N/A		MP5
  CH3 Signal		LED		MP6
  CH3 Clip			LED		MP7
  CH2 TM MIC		SW		MP8
  CH2 TM GUITAR		SW		MP9
  Codec1 dac LRCLK		N/A		MP10
  Codec2 dac LRCLK		N/A		MP11
  BT LRCLK		N/A		MP12
  CHARGE MANAGE		N/A		MP13
  CH1_TREBLE		pot		ADC0
  CH1_BASS		pot		ADC1
  CH1_REVERB		pot		ADC2
  CH2_TREBLE   		pot	                ADC3
  CH2_BASS		pot	    	ADC4
  CH2_REVERB		pot 		ADC5
- Unplug the USBI to keep I2C keep going to other device
- MP1-- Change the feedback resisters on the DAC buffer from 3k to 3.6k to increase 1.5dB gain
- MP1-- Change U60, U68 to RC4558
- MUTE DRV and CLM
- Reset:
  Change R62 from 51R to 1K
  Date:20181123
- DP1.52-- Add D60 for C228 and C229 bleeding when power off
- (near R105) DP1.52-- Change C132 C145 C146 C153 to 220pF
- MP1-- change U40 to RC4558
- Pilot-- Change R108/R111/R121/R123 to 470R; C132/C145/C146/C153 to 680pF
- Pilot-- Change C508/C509 to 1nF; C300/C301 to 4.7nF; delete C260/C277
- Version
- Date
- Description of Changes/Notes
- Client
- (Hui Zhou) Co. Ltd., Shenzhen Branch
- Premium Loudspeakers
- Product:
- File Name:
- Page Title:
- CHIBI
- CHIBI Main Board
- Requirement of Tymphany Parts:
  1. Comply with Tymphany QSI057-1031 "Green Product Chemical Substances Specification".
  2. Follow customer's specification as required.
  3. Follow Halogen Free requirement: Br<900 ppm, Cl<900 ppm, Br+Cl< 1500 ppm if required.
- www.Tymphany.com
- Tel: + 86 755-339-121-88
- GuangDong, P.R.C. 518049, China
- Futian District, Shenzhen
- No. 89 Ande Street, Shang Meilin
- 2/F, BBK Building
- Revision:
- Stage:
- Lead Engineer:
- Date:
- Part Number:
- SOP(Ver B)
- 3.1.1
- Sam
- T651000009390
- Drawn By:
- Checked By:
- Time:
- Gavin
- Mod By:
- Approved By:
- Sheet:
- Mod Date:
- Size:
- A2
- of
- Seb
- (in symbol CAP E 22uF 50V 20% SMD) +
- (in symbol CAP E 100uF 6.3V 20% SMD) +
- (in symbol RC4558IDR, part A) +; -

## Library data of the parts
C6 C33 C53 C56 C70 C82 C83 C91 C110 C113 C122 C129 C136 C137 = CAP0603 10uF 6.3V 20%: CHIP CAP 10uF 6.3V 20% 0603 X5R; SAP: T540000002118; Vendor Code: 10010262; Vendor Name: 东莞市晴远电子有限公司; Type: Capacitor; PACKAGE: CAPC0603; MFG: *; MFG Part: *; Other: X5R; Tolerance: 20%
  C6 C33 C53 C56: Voltage: 6.3V
C7 C9 C11 C16 C37-C39 C41 C54 C57 C61-C63 C71 C80 C86 C87 C99 C102 C123 C128 C135 C594 C612-C617 = CAP0402 0.1uF 50V 10%: CAP, CER, 0.1uF, 10%, 50V, X7R, 0402, RoHS; SAP: T542011047508; Type: Capacitor; CREATE_NAME: TOM@Deftronics; PACKAGE: CAPC0402; Vendor Name: *; MFG: *; MFG Part: *; Other: X7R; Tolerance: 10%; CREATE_TIME: 13-May-2014
  C7 C9 C11 C16 C37-C39 C41 C54 C57: Voltage: 50V
C8 C10 C14 C28 = CAP0402 0.01uF 50V 10%: CAP, CER, 0.01uF, 10%, 50V, X7R, 0402, RoHS; SAP: T542011037508; Type: Capacitor; CREATE_NAME: Evan@Deftronics; PACKAGE: CAPC0402; Vendor Name: *; MFG: *; MFG Part: *; Other: X7R; Tolerance: 10%; CREATE_TIME: 26-May-2014; Voltage: 50V
C55 = CAP0603 150pF 50V 10%: CHIP CAP 150 PF 50V 10% 0603 X7R; SAP: T542021517508; Vendor Code: 10010262; Vendor Name: 东莞市晴远电子有限公司; Type: Capacitor; PACKAGE: CAPC0603; MFG: *; MFG Part: *; Other: X7R; Tolerance: 10%; Voltage: 50V
C59 = CAP0402 5.6nF 16V 10%: CHIP CAP 10% 16V 0402 X7R  5.6nF; SAP: T542015627308; Vendor Name: 华新科技股份有限公司; MFG: Walsin; Type: Capacitor; PACKAGE: CAPC0402; MFG Part: *; Other: X7R; Tolerance: 10%; Voltage: 16V
C64 C112 C114 C118 C126 C127 C130 C132 C142 C145 C146 C153 = CAP0402 680pF 50V 5%: CHIP CAP 680pF 50V 5% 0402 TYPE NPO; SAP: T541016816508; Type: Capacitor; CREATE_NAME: GordonL@Deftronics; PACKAGE: CAPC0402; Vendor Code: *; Vendor Name: *; MFG: *; MFG Part: *; Other: NPO; Tolerance: 5%; CREATE_TIME: 05-Jan-2013
C65 C66 C105 C108 = CAP E 100uF 6.3V 20% SMD: CHIP ELECT 100uF 6.3V 20% SMD 5x5.3mm; SAP: T551101414000; Vendor Name: 深圳市春明电子有限公司; Vendor Code: 10020343; MFG: 春明电子; Type: Capacitor; PACKAGE: CASE - C; MFG Part: *; Other: *; Tolerance: 20%
C92 C116 C134 C150 = CAP0603 1.8nF 50V 10%: CHIP CAP 1.8nF 50V 10% 0603 X7R; SAP: T542021827508; MFG: 海能达; Type: Capacitor; PACKAGE: CAPC0603; Vendor Code: *; Vendor Name: *; MFG Part: *; Other: X7R; Tolerance: 10%
C98 C115 C139 C152 = CAP0402 470pF 50V 5% NP0: CAP CER 470pF 5% 50V NP0/C0G 0402 RoHS; SAP: T541014716508; Other: NPO; Type: Capacitor; CREATE_NAME: TOM@Deftronics; PACKAGE: CAPC0402; Vendor Name: *; MFG: *; MFG Part: *; Tolerance: 5%; CREATE_TIME: 13-May-2014
C117 C119 = CAP0402 22pF 50V 5%: CHIP CAP 5% 50V 0402 NPO 22pF; SAP: T541012206508; Type: Capacitor; CREATE_NAME: GordonL@Deftronics; PACKAGE: CAPC0402; Vendor Code: *; Vendor Name: *; MFG: *; MFG Part: *; Other: NPO; Tolerance: 5%; CREATE_TIME: 08-MAR-2013
C228 C229 C295 = CAP0603 1uF 25V 10% - PXL456450-1050: CHIP CAP 1uF 25V 10% 0603 TYPE X7R; SAP: T542021057408; Vendor Code: 10010262; Vendor Name: 东莞市晴远电子有限公司; Type: Capacitor; PACKAGE: CAPC0603; MFG: *; MFG Part: *; Other: X7R; Tolerance: 10%
C260 C277 = CAP0402 27pF 50V 5%: CHIP CAP 5% 50V 0402 NPO 27pF; Vendor Name: 华新科技股份有限公司; MFG: Walsin; Type: Capacitor; SAP: DNI; PACKAGE: CAPC0402; MFG Part: *; Other: NPO; Tolerance: 5%
C300 C301 = CAP0603 4.7nF 50V 10%: CHIP CAP 4.7nF 50V 10% 0603 X7R; SAP: T542024727508; Vendor Code: 10010262; Vendor Name: 东莞市晴远电子有限公司; Type: Capacitor; PACKAGE: CAPC0603; MFG: *; MFG Part: *; Other: X7R; Tolerance: 10%
C508 C509 = CAP0603 1000pF 50V 2%_NPO_WALSIN: CAP NPO 1000P 50V +-2% 0603 WALSIN L; Tolerance: 2%; Type: Capacitor; CREATE_NAME: Nathan; SAP: T541021025508; PACKAGE: CAPC0603; Vendor Name: *; MFG: WALSIN; MFG Part: *; Other: NPO; CREATE_TIME: 13-July-2016
C577 C578 = CAP E 22uF 50V 20% SMD: CHIP ELECT 20% 50V 22uF 6.3X5.4MM CK1H220M-CRE54SP00  -40~+105'C; SAP: T551220464000; MFG: SEMTECH; Type: Capacitor; CREAT_NAME: Nathan; PACKAGE: CASE - D; Vendor Name: *; Vendor Code: *; MFG Part: CK1H220M-CRE54SP00; Other: *; Tolerance: 20%; CREAT_TIME: 26-JAN-2015
D8 D10 D60 D61 = DAN217S3-0-T1-G: ITC 100V 215MA DAN217S3-0-T1-G CYSTE K; MFG: CYSTECH; Type: DIODES; Create Name: Nathan; SAP: T572006171251; Vendor Name: *; Vendor Code: *; MFG Part: DAN217S3-0-T1-G; Create Time: 08-Sep-2017
D26 = 1N4148WS: DIODE SW 1N4148 VF=0.7V SOD-323; MFG: TW SEMICONDUCTOR; SAP: T572005070208; Voltage: 100V; Current: 150MA; Vendor Name: *; Vendor Code: *; Type: DIODE; Package: SOD-323; MFG Part: 1N4148WS
J3 = PHONE JACK 6.35mm Switched CK6.35-3-14-18LF: 6.35MM JACK SOCKET PLASTIC BLACK K; MFG: JINJIA; CREATE_NAME: Nathan; SAP: T690300121700; Vendor Name: *; Vendor Code: *; Type: Connector; CREATE_TIME: 09-Nov-2017; MFG Part: CK6.35-3-14-18LF
J35 = CONN 6P PH=2.0MM ST_PH-6A-CS: CONNECTOR 6IN 2.0MM DIP 180 K; MFG: 金佳电子; CREATE_NAME: Nathan; SAP: DNI; Vendor Name: *; Vendor Code: *; CREATE_TIME: 10-May-2017; MFG Part: PH-6A-CS; Type: Connector; Current: *
JD11A = CONN 11P PH=1.5MM ST SMT ZH-11AT-JK: SMT CONNECTOR 11PIN P=1.5MM 90 NICKEL G; CREATE_NAME: Nathan; MFG: JINJIA; CURRENT: 1.5A; CREATE_TIME: 12-Sep-2017; SAP: T690300109300; MFG Part: ZH-11AT-JK; Vendor Name: *; Vendor code: *; Type: *; Package: *
L1 L3-L6 L8 L9 = BEAD 0603 600R@100MHz TI60808U601: CHIP BEAD 600 OHM 25% 100MHZ SMD 0603; SAP: T710500000800; Vendor Code: 10020396; Vendor Name: 深圳市麦新电子有限公司; MFG: 麦新; Impedence: 600R; Current: 1A; Type: INDUCTOR; Frequency: 100MHZ; MFG Part: TI60808U601
  L3: VALUE: 600R@100MHz
Q1 = BSS84-7-F: PMOS -50V BSS84-7-F SOT23 DIODES G; Create Name: Tom; SAP: T585001160438; MFG: DIODES; Vendor Code: *; Vendor Name: *; Power: *; Voltage: -50V; Type: PMOS; MFG Part: BSS84-7-F; Create Time: 18-May-2016
Q2 Q4 Q5 Q16 = 2N7002DW: SMD MOSFET N-CH SOT-363 2N7002DW      Fairchild; SAP: T586002602738; CREATE_NAME: Evan@Deftronics; MFG: Fairchild; Vendor Name: *; Vendor Code: *; Voltage: *; Current: *; Type: MOSFET; CREATE_TIME: 7-May-2014; MFG_Part: 2N7002DW
Q6 = L2N7002LT1G: CHIP MOSFET 2N7002 SOT-23; SAP: T586001860437; Vendor Code: 10009129; Vendor Name: WING HING ENTERPRISE CO; MFG: LRC; Power: *; Voltage: *; Type: MOSFET; MFG Part: L2N7002LT1G
Q29 = HBN3904S6R: NPN 40V HBN3904S6R SOT-36 CYSTEC K; MFG: CYSTECH  (全宇昕科技); Type: NPN TRANSISTOR; CREATE_NAME: Nathan; SAP: T581004124899; Vendor: *; Vendor Code: *; CREATE_TIME: 10-Oct-2017; MFG Part: HBN3904S6R
Q60 = MMBT3904WT1: NPN 40V MMBT3904WT1 SC70 ( ON K; CREATE_NAME: Nathan; SAP: T581003992440; MFG: ON; Vendor Code: *; Vendor Name: *; Voltage: *; Type: NPN; CREATE_TIME: 17-Oct-2017; Current: *; MFG Part: MMBT3904WT1
R14 R20 R23 R27 R28 R35 R134 R136 = RES0402 1/16W 1% 47 OHM: CHIP RES 47 OHM 1/16W 1% 0402; SAP: T502470A01399; MFG: WALSIN; Vendor Code: *; Power: *; Vendor Name: *; MFG Part: *; TOL: 1%; Type: Resistor; PACKAGE: 0402
R38 R43 R63 R64 R76 R77 R342 R346 = RES0402 1/16W 1% 1K OHM: CHIP RES 1K OHM 1/16W 1% 0402; SAP: T502100101399; MFG: WALSIN; Vendor Code: *; Power: *; Vendor Name: *; MFG Part: *; TOL: 1%; Type: Resistor; PACKAGE: 0402
R39 R40 R106 R107 R109 R112 R116 R120 = RES0402 1/16W 1% 6.2K OHM: CHIP 6.2K OHM 100PPM +-1% 0402 WALS L; MFG: WALS L; Power: 1/16W; CREATE_NAME: Tom; SAP: T502620101399; Package: 0402; TOL: +-1%; MFG Part: *; Vendor Code: *; Vendor Name: *; Type: Resistor; CREATE_TIME: 26-Nov-2015
R46 = RES0402 1/16W 1% 4.32K OMH_WALSIN: CHIP 4.32K OHM 100PPM +-1% 0402 WALS L; TOL: 1%; MFG: WALSIN (華新); Power: 1/16W; CREATE_NAME: Nathan; SAP: T502432101399; Package: 0402; MFG Part: *; Vendor Code: *; Vendor Name: *; Type: Resistor; CREATE_TIME: 25-May-2016
R54 R55 R57 R58 R67 R68 R82 R83 R212 R512-R515 = RES0402 1/16W 1% 100 OHM: CHIP RES 100 OHM 1/16W 1% 0402; SAP: T502100001399; MFG: WALSIN; Vendor Code: *; Power: *; Vendor Name: *; MFG Part: *; TOL: 1%; Type: Resistor; PACKAGE: 0402
R56 R94 R95 R98 R103 R181 R183 R190 R340 R604 = RES0402 1/16W 1% 10K OHM: CHIP RES 10K OHM 1/16W 1% 0402; SAP: T502100201399; MFG: WALSIN; Vendor Code: *; Power: *; Vendor Name: *; MFG Part: *; TOL: 1%; Type: Resistor
  R56 R94 R95 R98 R103 R181 R183 R190 R340: PACKAGE: 0402
R57X R58X = RES0402 1/16W 1% 100 OHM: CHIP RES 100 OHM 1/16W 1% 0402; MFG: WALSIN; Vendor Code: *; SAP: DNI; Power: *; Vendor Name: *; MFG Part: *; TOL: 1%; Type: Resistor; PACKAGE: 0402
R60 R603 = RES0402 1/16W 1% 2.2K OHM-QCF161240-2201: CHIP RES 2.2K OHM 1/16W 1% 0402; SAP: T502220101399; CREATE_NAME: Evan@Deftronics; Vendor Code: *; Power: *; Vendor Name: *; MFG Part: *; MFG: *; TOL: 1%; Type: Resistor; CREATE_TIME: 23-Apr-2014; PACKAGE: 0402
R61 = RES0402 1/16W 1% 51 OHM: CHIP RES  51 OHM 1/16W 1% 0402; SAP: T502510A01399; CREATE_NAME: GordonL@Deftronics; Vendor Code: *; Power: 1/16W; Vendor Name: *; MFG Part: *; MFG: *; TOL: 1%; CREATE_TIME: 05-Jan-2013; Type: Resistor; PACKAGE: 0402
R62 = RES0603 1/10W 1% 1K OHM: GP CHIP RES. 1K OHM 1/10W 1% 0603; Vendor Code: 10010262; SAP: T502100102399; Vendor Name: 东莞市晴远电子有限公司; Power: *; MFG: *; MFG Part: *; TOL: 1%; Type: Resistor; PACKAGE: 0603
R65 R88 R91 R97 R169 R201 = RES0402 1/16W 1% 47K OHM: CHIP RES 47K 1/16W 1% 0402; SAP: T502470201399; MFG: WALSIN; Vendor Code: *; Power: *; Vendor Name: *; MFG Part: *; TOL: 1%; Type: Resistor; PACKAGE: 0402
R69 R74 R75 R84 R85 R92 R93 R102 = RES0402 1/16W 1% 3.6K OMH_WALSIN: CHIP 3.6K OHM  100PPM +-1% 0402 WALS G; TOL: 1%; MFG: WALSIN (華新); Power: 1/16W; CREATE_NAME: Nathan; SAP: T502360101399; Package: 0402; MFG Part: *; Vendor Code: *; Vendor Name: *; Type: Resistor; CREATE_TIME: 25-May-2016
R70 R72 R78 R80 R86 R89 R96 R100 = RES0402 1/16W 5.6K: CHIP RES 5.6K OHM 1/16W; CREATE_NAME: Tom; Vendor Code: *; SAP: T502560101399; Power: *; Vendor Name: *; MFG Part: *; MFG: *; TOL: *; Type: Resistor; CREATE_TIME: 09-Sep-2015; PACKAGE: 0402
R71 R73 R79 R81 R87 R90 R99 R101 = RES0402 1/16W 1% 180 OMH_WALSIN: CHIP 180 OHM   100PPM +-1% 0402 WALS L; TOL: 1%; MFG: WALSIN (華新); Power: 1/16W; CREATE_NAME: Nathan; SAP: T502180001399; Package: 0402; MFG Part: *; Vendor Code: *; Vendor Name: *; Type: Resistor; CREATE_TIME: 25-May-2016
R104 R344 = RES0402 1/16W 1% 1M OHM: CHIP RES 1M OHM 1/16W 1% 0402; SAP: T502100401399; MFG: WALSIN; Vendor Code: *; Power: *; Vendor Name: *; MFG Part: *; TOL: 1%; Type: Resistor; PACKAGE: 0402
R105 R114 R115 R127 = RES0402 1/16W 1% 7.5K OMH_WALSIN: CHIP 7.5K OHM  100PPM +-1% 0402 WALS L; TOL: 1%; MFG: WALSIN (華新); Power: 1/16W; CREATE_NAME: Nathan; SAP: T502750101399; Package: 0402; MFG Part: *; Vendor Code: *; Vendor Name: *; Type: Resistor; CREATE_TIME: 25-May-2016
R108 R111 R121 R123 = RES0402 1/16W 1% 470 OHM: CHIP RES 470 OHM 1/16W 1% 0402; SAP: T502470001399; MFG: WALSIN; Vendor Code: *; Power: *; Vendor Name: *; MFG Part: *; TOL: 1%; Type: Resistor; PACKAGE: 0402
R147 = RES0402 1/16W 1% 47K OHM: CHIP RES 47K 1/16W 1% 0402; MFG: WALSIN; Vendor Code: *; SAP: DNI; Power: *; Vendor Name: *; MFG Part: *; TOL: 1%; Type: Resistor; PACKAGE: 0402
R199 R204 = RES0402 1/16W 1% 100K OHM-QCF161240-1003: CHIP RES 100K OHM 1/16W 1% 0402; SAP: T502100301399; MFG: WALSIN; Vendor Code: *; Power: *; Vendor Name: *; MFG Part: *; TOL: 1%; Type: Resistor; PACKAGE: 0402
R230 = RES0402 1/16W 0 OHM JUMPER: CHIP RES 0 OHM 5% 1/16W 0402; SAP: T5020000014A9; CREATE_NAME: TOM@Deftronics; Package: 0402; TOL: 5%; MFG Part: *; MFG: *; Vendor Code: *; Vendor Name: *; Type: Resistor; Power: *; CREATE_TIME: 13-May-2014
R235 R247 = RES0603 1/10W 1% 100 OHM: CHIP 100 OHM 100PPM +-1% 0603 WALS L; Vendor Code: 10010262; SAP: T502100002399; Vendor Name: 东莞市晴远电子有限公司; MFG: WALSIN (華新); TOL: 1%; Power: *; MFG Part: *; Type: Resistor; PACKAGE: 0603
R308 R316 = RES0603 1/10W 1% 47K OHM: GP CHIP RES. 47K OHM 1/10W 1% 0603; Vendor Code: 10010262; SAP: T502470202399; Vendor Name: 东莞市晴远电子有限公司; Power: *; MFG Part: *; MFG: *; TOL: 1%; Type: Resistor; PACKAGE: 0603
R339 R343 R348 = RES0603 1/10W 1% 330K OHM: CHIP RES. 330K OHM 1/10W 1% 0603; Vendor Code: 10010262; SAP: T502330302399; Vendor Name: 东莞市晴远电子有限公司; Power: *; MFG Part: *; MFG: *; TOL: 1%; Type: Resistor; PACKAGE: 0603
R345 = RES0402 1/16W 1% 560K OHM: CHIP RES 560K OHM  1% 1/16W 0402; SAP: T502560301399; CREATE_NAME: Nathan; Package: 0402; TOL: 1%; MFG Part: *; MFG: *; Vendor Code: *; Vendor Name: *; Type: Resistor; Power: 1/16W; CREATE_TIME: 12-JAN-2015
R602 = RES0603 1/10W 0 OHM_WALSIN: CHIP 0 OHM 0 OHM 0 OHM 0603 WALSIN L; MFG Part: WR06X000PTL; MFG: WALSIN (華新); Vendor Code: *; SAP: T502000002009; Power: *; Vendor Name: *; TOL: *; Type: Resistor; PACKAGE: 0603
R605 = RES0402 1/16W 1% 22K OHM: CHIP RES 22K OHM 1/16W 1% 0402; SAP: T502220201399; MFG: WALSIN; Vendor Code: *; Power: *; Vendor Name: *; MFG Part: *; TOL: 1%; Type: Resistor
SW2 = SS-23E03-G5 PA: SLIDE SWITCH 8P SS-23E03-G PA K; MFG: C&K; Value: 2P3T; Voltage: 50V; CREATE_NAME: Nathan; SAP: T670600002700; Vendor Code: *; Vendor Name: *; Current: *; Type: Switch; CREATE_TIME: 15-Mar-2017; MFG Part: SS-23E03-G5 PA
TP4 TP17-TP21 TP26-TP30 TP34 TP39 TP91 = TP
U10 = MAX809STRG_ON SEMI: MCU MAX809STRG SOT23-3 ON SEMI G; MFG: ON SEMI; CREASE_NAME: TOM@Deftronics; SAP: T610300090588; Vendor Code: *; Vendor Name: *; Type: IC; CREASE_TIME: 4-JULY-2013
U11 U50 = CS4272-CZZ: IC CODEC CS4272-CZZ TSSOP-28; SAP: T611500002006; MFG: CIRRUS LOGIC; CREATE_NAME: GordonL@Deftronics; Vendor Name: *; Vendor Code: *; CREATE_TIME: 31-MAY-2013; Type: IC; MFG Part: CS4272-CZZ
U21 = ADAU1451: CREATE_NAME: Tom; SAP: T610000050936; MFG: *; Vendor Name: *; Vendor Code: *; Package: LQFP128; CREATE_TIME: 27-Oct-2015; Type: IC; MFG Part: ADAU1451
U40 U60 U68 = RC4558IDR: OP RC4558IDR SOP-8 TI G; CREATE_NAME: Nathan; CREATE_TIME: 16-Aug-2017; MFG: TI; SAP: T610500019101; TYPE: IC; Value: *; Vender Code: *; Vender Name: *; MFG Part: RC4558IDR
VR1 VR3 VR5-VR8 = RV09BCF-40-25F-B10K: ROTARY 10k OHM RV09BCF-40-25F-B10K; SAP: T531220003000; MFG: 艾华电子; CREATE_NAME: Evan@Deftronics; Vendor Code: *; Vendor Name: *; Value: 10K; Type: Switch; CREATE_TIME: 29-Apr-2014; MFG Part: RV09BCF-40-25F-B10K
Y1 = CRY 24.576MHz_XTL571200-F98-048: CRYSTAL 24.576MH SMD SIWARD XTL571200-F98-048 G; MFG: STWARD; CREATE_NAME: Nathan; SAP: T690900003500; MFG Part: XTL571200-F98-048; Vendor Code: *; Vendor Name: *; Frequency Tolerance: *; Eqivalent resistance: *; Type: Crystal; Capacitance: *; CREATE_TIME: 21-Feb-2017
Z1 = BZX884-C15: CHIP ZENER 250mW SOD-882 BZX884-C15 15V; MFG: NXP; SAP: T573003501815; CREATE_NAME: XIN@Deftronics; Vendor Name: *; Vendor Code: *; Voltage: 15V; Current: *; CREATE_TIME: 17-Apr-2014; MFG Part: BZX884-C15; Type: DIODE; Package: SOD882